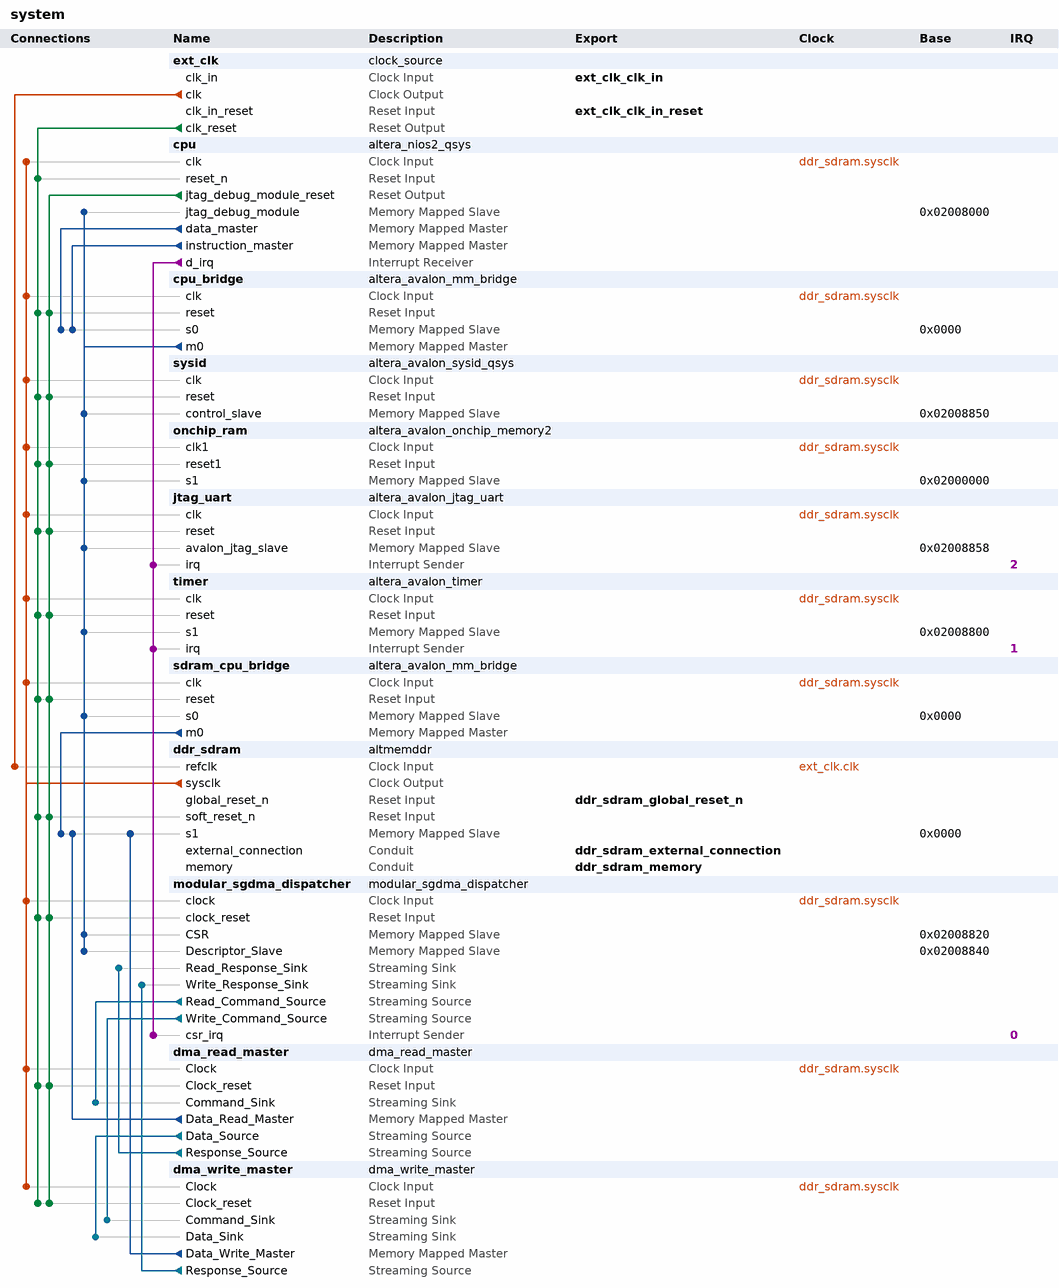
[diagram p0: system contents]
# Platform Designer (Qsys) system system, Cyclone III EP3C25F324C6
# Parameters at their usual value, and those the tool derives, are not listed.
package require -exact qsys 12.1
create_system system
set_project_property DEVICE_FAMILY {Cyclone III}
set_project_property DEVICE EP3C25F324C6

add_instance ext_clk clock_source 12.1
set_instance_parameter_value ext_clk clockFrequency 50000000

add_instance cpu altera_nios2_qsys 12.1
set_instance_parameter_value cpu manuallyAssignCpuID false
set_instance_parameter_value cpu resetSlave onchip_ram.s1
set_instance_parameter_value cpu exceptionSlave onchip_ram.s1
set_instance_parameter_value cpu breakSlave cpu.jtag_debug_module
set_instance_parameter_value cpu impl Fast
set_instance_parameter_value cpu icache_size 4096

add_instance cpu_bridge altera_avalon_mm_bridge 12.1
set_instance_parameter_value cpu_bridge DATA_WIDTH 32
set_instance_parameter_value cpu_bridge ADDRESS_WIDTH 26
set_instance_parameter_value cpu_bridge ADDRESS_UNITS SYMBOLS
set_instance_parameter_value cpu_bridge MAX_PENDING_RESPONSES 38

add_instance sysid altera_avalon_sysid_qsys 12.1
set_instance_parameter_value sysid id 0

add_instance onchip_ram altera_avalon_onchip_memory2 12.1
set_instance_parameter_value onchip_ram dataWidth 32
set_instance_parameter_value onchip_ram dualPort false
set_instance_parameter_value onchip_ram initMemContent false
set_instance_parameter_value onchip_ram initializationFileName onchip_ram
set_instance_parameter_value onchip_ram memorySize 32768

add_instance jtag_uart altera_avalon_jtag_uart 12.1
set_instance_parameter_value jtag_uart simInteractiveOptions INTERACTIVE_ASCII_OUTPUT

add_instance timer altera_avalon_timer 12.1
set_instance_parameter_value timer period 1
set_instance_parameter_value timer periodUnits MSEC
set_instance_parameter_value timer timerPreset CUSTOM

add_instance sdram_cpu_bridge altera_avalon_mm_bridge 12.1
set_instance_parameter_value sdram_cpu_bridge DATA_WIDTH 32
set_instance_parameter_value sdram_cpu_bridge ADDRESS_WIDTH 25
set_instance_parameter_value sdram_cpu_bridge ADDRESS_UNITS SYMBOLS
set_instance_parameter_value sdram_cpu_bridge MAX_PENDING_RESPONSES 35

add_instance ddr_sdram altmemddr 12.1
set_instance_parameter_value ddr_sdram pipeline_commands false
set_instance_parameter_value ddr_sdram debug_en false
set_instance_parameter_value ddr_sdram export_debug_port false
set_instance_parameter_value ddr_sdram use_generated_memory_model true
set_instance_parameter_value ddr_sdram dedicated_memory_clk_phase_label {Dedicated memory clock phase:}
set_instance_parameter_value ddr_sdram mem_if_clk_mhz 133.0
set_instance_parameter_value ddr_sdram quartus_project_exists false
set_instance_parameter_value ddr_sdram local_if_drate Full
set_instance_parameter_value ddr_sdram enable_v72_rsu false
set_instance_parameter_value ddr_sdram local_if_clk_mhz_label 133.0
set_instance_parameter_value ddr_sdram new_variant false
set_instance_parameter_value ddr_sdram mem_if_memtype {DDR SDRAM}
set_instance_parameter_value ddr_sdram pll_ref_clk_mhz 50.0
set_instance_parameter_value ddr_sdram mem_if_clk_ps_label {(7519 ps)}
set_instance_parameter_value ddr_sdram family {Cyclone III}
set_instance_parameter_value ddr_sdram project_family {Cyclone III}
set_instance_parameter_value ddr_sdram speed_grade 6
set_instance_parameter_value ddr_sdram dedicated_memory_clk_phase 0
set_instance_parameter_value ddr_sdram pll_ref_clk_ps_label {(20000 ps)}
set_instance_parameter_value ddr_sdram avalon_burst_length 1
set_instance_parameter_value ddr_sdram mem_if_clk_pair_count 1
set_instance_parameter_value ddr_sdram mem_if_cs_per_dimm 1
set_instance_parameter_value ddr_sdram pre_latency_label {Fix read latency at:}
set_instance_parameter_value ddr_sdram dedicated_memory_clk_en false
set_instance_parameter_value ddr_sdram mirror_addressing 0
set_instance_parameter_value ddr_sdram mem_if_bankaddr_width 2
set_instance_parameter_value ddr_sdram register_control_word_9 0000
set_instance_parameter_value ddr_sdram mem_if_rowaddr_width 13
set_instance_parameter_value ddr_sdram mem_dyn_deskew_en false
set_instance_parameter_value ddr_sdram post_latency_label {cycles (0 cycles=minimum latency, non-deterministic)}
set_instance_parameter_value ddr_sdram mem_if_dm_pins_en Yes
set_instance_parameter_value ddr_sdram local_if_dwidth_label 32
set_instance_parameter_value ddr_sdram register_control_word_7 0000
set_instance_parameter_value ddr_sdram register_control_word_8 0000
set_instance_parameter_value ddr_sdram mem_if_preset {PSC A2S56D40CTP-G5}
set_instance_parameter_value ddr_sdram mem_if_pchaddr_bit 10
set_instance_parameter_value ddr_sdram WIDTH_RATIO 4
set_instance_parameter_value ddr_sdram vendor Other
set_instance_parameter_value ddr_sdram register_control_word_3 0000
set_instance_parameter_value ddr_sdram register_control_word_4 0000
set_instance_parameter_value ddr_sdram chip_or_dimm {Discrete Device}
set_instance_parameter_value ddr_sdram register_control_word_5 0000
set_instance_parameter_value ddr_sdram register_control_word_6 0000
set_instance_parameter_value ddr_sdram mem_fmax 200.0
set_instance_parameter_value ddr_sdram register_control_word_0 0000
set_instance_parameter_value ddr_sdram register_control_word_size 4
set_instance_parameter_value ddr_sdram register_control_word_1 0000
set_instance_parameter_value ddr_sdram register_control_word_2 0000
set_instance_parameter_value ddr_sdram register_control_word_11 0000
set_instance_parameter_value ddr_sdram register_control_word_10 0000
set_instance_parameter_value ddr_sdram mem_if_cs_width 1
set_instance_parameter_value ddr_sdram mem_if_preset_rlat 0
set_instance_parameter_value ddr_sdram mem_if_cs_per_rank 1
set_instance_parameter_value ddr_sdram fast_simulation_en FAST
set_instance_parameter_value ddr_sdram register_control_word_15 0000
set_instance_parameter_value ddr_sdram register_control_word_14 0000
set_instance_parameter_value ddr_sdram mem_if_dwidth 16
set_instance_parameter_value ddr_sdram mem_if_dq_per_dqs 8
set_instance_parameter_value ddr_sdram mem_if_coladdr_width 9
set_instance_parameter_value ddr_sdram register_control_word_13 0000
set_instance_parameter_value ddr_sdram register_control_word_12 0000
set_instance_parameter_value ddr_sdram mem_tiha_ps 600
set_instance_parameter_value ddr_sdram mem_tdsh_ck 0.2
set_instance_parameter_value ddr_sdram mem_if_trfc_ns 70.0
set_instance_parameter_value ddr_sdram mem_tqh_ck 0.36
set_instance_parameter_value ddr_sdram mem_tisa_ps 600
set_instance_parameter_value ddr_sdram mem_tdss_ck 0.2
set_instance_parameter_value ddr_sdram mem_trtp_ns 0.0
set_instance_parameter_value ddr_sdram mem_if_tinit_us 200.0
set_instance_parameter_value ddr_sdram mem_if_trcd_ns 15.0
set_instance_parameter_value ddr_sdram mem_if_twtr_ck 2
set_instance_parameter_value ddr_sdram mem_trrd_ns 10.0
set_instance_parameter_value ddr_sdram mem_tdqss_ck 0.28
set_instance_parameter_value ddr_sdram mem_tqhs_ps 500
set_instance_parameter_value ddr_sdram mem_tdsa_ps 400
set_instance_parameter_value ddr_sdram mem_tac_ps 700
set_instance_parameter_value ddr_sdram mem_tdha_ps 400
set_instance_parameter_value ddr_sdram mem_if_tras_ns 40.0
set_instance_parameter_value ddr_sdram mem_if_twr_ns 15.0
set_instance_parameter_value ddr_sdram mem_tdqsck_ps 550
set_instance_parameter_value ddr_sdram mem_if_trp_ns 15.0
set_instance_parameter_value ddr_sdram mem_tdqsq_ps 400
set_instance_parameter_value ddr_sdram mem_if_tmrd_ns 10.0
set_instance_parameter_value ddr_sdram mem_tfaw_ns 0.0
set_instance_parameter_value ddr_sdram mem_if_trefi_us 7.0
set_instance_parameter_value ddr_sdram mem_tcl_40_fmax 533.0
set_instance_parameter_value ddr_sdram mem_odt Disabled
set_instance_parameter_value ddr_sdram mp_WLH_percent 0.6
set_instance_parameter_value ddr_sdram mem_drv_str Normal
set_instance_parameter_value ddr_sdram mp_DH_percent 0.5
set_instance_parameter_value ddr_sdram input_period 0
set_instance_parameter_value ddr_sdram mp_QH_percent 0.5
set_instance_parameter_value ddr_sdram mp_QHS_percent 0.5
set_instance_parameter_value ddr_sdram mem_tcl_30_fmax 200.0
set_instance_parameter_value ddr_sdram ac_clk_select 90
set_instance_parameter_value ddr_sdram mp_DQSQ_percent 0.65
set_instance_parameter_value ddr_sdram mp_DS_percent 0.6
set_instance_parameter_value ddr_sdram pll_reconfig_ports_en false
set_instance_parameter_value ddr_sdram mem_btype Sequential
set_instance_parameter_value ddr_sdram mp_IS_percent 0.7
set_instance_parameter_value ddr_sdram mem_tcl 3.0
set_instance_parameter_value ddr_sdram mp_DQSS_percent 0.5
set_instance_parameter_value ddr_sdram export_bank_info false
set_instance_parameter_value ddr_sdram mp_DSS_percent 0.6
set_instance_parameter_value ddr_sdram mem_dll_en Yes
set_instance_parameter_value ddr_sdram ac_phase 90
set_instance_parameter_value ddr_sdram mem_if_oct_en false
set_instance_parameter_value ddr_sdram mem_tcl_60_fmax 533.0
set_instance_parameter_value ddr_sdram mp_DSH_percent 0.6
set_instance_parameter_value ddr_sdram mem_if_dqsn_en false
set_instance_parameter_value ddr_sdram enable_mp_calibration true
set_instance_parameter_value ddr_sdram mp_IH_percent 0.6
set_instance_parameter_value ddr_sdram mem_tcl_15_fmax 533.0
set_instance_parameter_value ddr_sdram dll_external false
set_instance_parameter_value ddr_sdram mem_bl 4
set_instance_parameter_value ddr_sdram mp_WLS_percent 0.7
set_instance_parameter_value ddr_sdram mem_tcl_50_fmax 533.0
set_instance_parameter_value ddr_sdram mp_DQSCK_percent 0.5
set_instance_parameter_value ddr_sdram mem_tcl_25_fmax 200.0
set_instance_parameter_value ddr_sdram mem_tcl_20_fmax 133.333
set_instance_parameter_value ddr_sdram cfg_reorder_data true
set_instance_parameter_value ddr_sdram ctl_ecc_en false
set_instance_parameter_value ddr_sdram ctl_hrb_en false
set_instance_parameter_value ddr_sdram ref_clk_source ext_clk
set_instance_parameter_value ddr_sdram cfg_data_reordering_type INTER_BANK
set_instance_parameter_value ddr_sdram ctl_powerdn_en false
set_instance_parameter_value ddr_sdram multicast_wr_en false
set_instance_parameter_value ddr_sdram auto_powerdn_cycles 0
set_instance_parameter_value ddr_sdram ctl_self_refresh_en false
set_instance_parameter_value ddr_sdram cfg_starve_limit 10
set_instance_parameter_value ddr_sdram ctl_latency 0
set_instance_parameter_value ddr_sdram tool_context SOPC_BUILDER
set_instance_parameter_value ddr_sdram mem_addr_mapping CHIP_ROW_BANK_COL
set_instance_parameter_value ddr_sdram burst_merge_en false
set_instance_parameter_value ddr_sdram user_refresh_en false
set_instance_parameter_value ddr_sdram qsys_mode true
set_instance_parameter_value ddr_sdram clk_source_sharing_en false
set_instance_parameter_value ddr_sdram ctl_lookahead_depth 4
set_instance_parameter_value ddr_sdram ctl_autopch_en false
set_instance_parameter_value ddr_sdram ctl_dynamic_bank_allocation false
set_instance_parameter_value ddr_sdram ctl_dynamic_bank_num 4
set_instance_parameter_value ddr_sdram local_if_type_avalon true
set_instance_parameter_value ddr_sdram csr_en false
set_instance_parameter_value ddr_sdram ctl_auto_correct_en false
set_instance_parameter_value ddr_sdram auto_powerdn_en false
set_instance_parameter_value ddr_sdram phy_if_type_afi true
set_instance_parameter_value ddr_sdram controller_type ngv110_ctl
set_instance_parameter_value ddr_sdram max_local_size 2
set_instance_parameter_value ddr_sdram mem_srtr Normal
set_instance_parameter_value ddr_sdram mem_mpr_loc {Predefined Pattern}
set_instance_parameter_value ddr_sdram dss_tinit_rst_us 200.0
set_instance_parameter_value ddr_sdram mem_tcl_90_fmax 400.0
set_instance_parameter_value ddr_sdram mem_rtt_wr {Dynamic ODT off}
set_instance_parameter_value ddr_sdram mem_tcl_100_fmax 400.0
set_instance_parameter_value ddr_sdram mem_pasr {Full Array}
set_instance_parameter_value ddr_sdram mem_asrm {Manual SR Reference (SRT)}
set_instance_parameter_value ddr_sdram mem_mpr_oper {Predefined Pattern}
set_instance_parameter_value ddr_sdram mem_tcl_80_fmax 400.0
set_instance_parameter_value ddr_sdram mem_drv_impedance RZQ/7
set_instance_parameter_value ddr_sdram mem_rtt_nom {ODT Disabled}
set_instance_parameter_value ddr_sdram mem_tcl_70_fmax 400.0
set_instance_parameter_value ddr_sdram mem_wtcl 5.0
set_instance_parameter_value ddr_sdram mem_dll_pch {Fast Exit}
set_instance_parameter_value ddr_sdram mem_atcl Disabled
set_instance_parameter_value ddr_sdram board_settings_valid true
set_instance_parameter_value ddr_sdram t_IH 0.6
set_instance_parameter_value ddr_sdram board_intra_DQS_group_skew 0.02
set_instance_parameter_value ddr_sdram isi_DQS 0.0
set_instance_parameter_value ddr_sdram addr_cmd_slew_rate 1.0
set_instance_parameter_value ddr_sdram board_tpd_inter_DIMM 0.05
set_instance_parameter_value ddr_sdram board_addresscmd_CK_skew 0.0
set_instance_parameter_value ddr_sdram t_DS_calculated 0.400
set_instance_parameter_value ddr_sdram isi_addresscmd_hold 0.0
set_instance_parameter_value ddr_sdram t_IS 0.6
set_instance_parameter_value ddr_sdram restore_default_toggle false
set_instance_parameter_value ddr_sdram dqs_dqsn_slew_rate 2.0
set_instance_parameter_value ddr_sdram dq_slew_rate 1.0
set_instance_parameter_value ddr_sdram board_inter_DQS_group_skew 0.02
set_instance_parameter_value ddr_sdram isi_addresscmd_setup 0.0
set_instance_parameter_value ddr_sdram board_minCK_DQS_skew -0.01
set_instance_parameter_value ddr_sdram t_IS_calculated 0.600
set_instance_parameter_value ddr_sdram num_slots_or_devices 1
set_instance_parameter_value ddr_sdram board_maxCK_DQS_skew 0.01
set_instance_parameter_value ddr_sdram board_skew_ps 20
set_instance_parameter_value ddr_sdram t_DH 0.4
set_instance_parameter_value ddr_sdram ck_ckn_slew_rate 2.0
set_instance_parameter_value ddr_sdram isi_DQ 0.0
set_instance_parameter_value ddr_sdram t_IH_calculated 0.600
set_instance_parameter_value ddr_sdram t_DH_calculated 0.400
set_instance_parameter_value ddr_sdram t_DS 0.4

add_instance modular_sgdma_dispatcher modular_sgdma_dispatcher 1.0
set_instance_parameter_value modular_sgdma_dispatcher MODE 0
set_instance_parameter_value modular_sgdma_dispatcher GUI_RESPONSE_PORT 2
set_instance_parameter_value modular_sgdma_dispatcher DESCRIPTOR_FIFO_DEPTH 128
set_instance_parameter_value modular_sgdma_dispatcher ENHANCED_FEATURES 0
set_instance_parameter_value modular_sgdma_dispatcher CSR_ADDRESS_WIDTH 3

add_instance dma_read_master dma_read_master 1.0
set_instance_parameter_value dma_read_master DATA_WIDTH 32
set_instance_parameter_value dma_read_master LENGTH_WIDTH 20
set_instance_parameter_value dma_read_master FIFO_DEPTH 64
set_instance_parameter_value dma_read_master STRIDE_ENABLE 0
set_instance_parameter_value dma_read_master GUI_STRIDE_WIDTH 1
set_instance_parameter_value dma_read_master BURST_ENABLE 1
set_instance_parameter_value dma_read_master GUI_MAX_BURST_COUNT 2
set_instance_parameter_value dma_read_master GUI_PROGRAMMABLE_BURST_ENABLE 0
set_instance_parameter_value dma_read_master GUI_BURST_WRAPPING_SUPPORT 1
set_instance_parameter_value dma_read_master TRANSFER_TYPE {Aligned Accesses}
set_instance_parameter_value dma_read_master PACKET_ENABLE 0
set_instance_parameter_value dma_read_master ERROR_ENABLE 0
set_instance_parameter_value dma_read_master ERROR_WIDTH 8
set_instance_parameter_value dma_read_master CHANNEL_ENABLE 0
set_instance_parameter_value dma_read_master CHANNEL_WIDTH 8
set_instance_parameter_value dma_read_master ADDRESS_WIDTH 25
set_instance_parameter_value dma_read_master FIFO_SPEED_OPTIMIZATION 1

add_instance dma_write_master dma_write_master 1.0
set_instance_parameter_value dma_write_master DATA_WIDTH 32
set_instance_parameter_value dma_write_master LENGTH_WIDTH 20
set_instance_parameter_value dma_write_master FIFO_DEPTH 64
set_instance_parameter_value dma_write_master STRIDE_ENABLE 0
set_instance_parameter_value dma_write_master GUI_STRIDE_WIDTH 1
set_instance_parameter_value dma_write_master BURST_ENABLE 1
set_instance_parameter_value dma_write_master GUI_MAX_BURST_COUNT 2
set_instance_parameter_value dma_write_master GUI_PROGRAMMABLE_BURST_ENABLE 0
set_instance_parameter_value dma_write_master GUI_BURST_WRAPPING_SUPPORT 1
set_instance_parameter_value dma_write_master TRANSFER_TYPE {Aligned Accesses}
set_instance_parameter_value dma_write_master PACKET_ENABLE 0
set_instance_parameter_value dma_write_master ERROR_ENABLE 0
set_instance_parameter_value dma_write_master ERROR_WIDTH 8
set_instance_parameter_value dma_write_master ADDRESS_WIDTH 25
set_instance_parameter_value dma_write_master FIFO_SPEED_OPTIMIZATION 1

# connections
add_connection ddr_sdram.sysclk cpu.clk clock
add_connection ddr_sdram.sysclk cpu_bridge.clk clock
add_connection ddr_sdram.sysclk dma_read_master.Clock clock
add_connection ddr_sdram.sysclk dma_write_master.Clock clock
add_connection ddr_sdram.sysclk jtag_uart.clk clock
add_connection ddr_sdram.sysclk modular_sgdma_dispatcher.clock clock
add_connection ddr_sdram.sysclk onchip_ram.clk1 clock
add_connection ddr_sdram.sysclk sdram_cpu_bridge.clk clock
add_connection ddr_sdram.sysclk sysid.clk clock
add_connection ddr_sdram.sysclk timer.clk clock
add_connection ext_clk.clk ddr_sdram.refclk clock
add_connection cpu.jtag_debug_module_reset cpu_bridge.reset reset
add_connection cpu.jtag_debug_module_reset ddr_sdram.soft_reset_n reset
add_connection cpu.jtag_debug_module_reset dma_read_master.Clock_reset reset
add_connection cpu.jtag_debug_module_reset dma_write_master.Clock_reset reset
add_connection cpu.jtag_debug_module_reset jtag_uart.reset reset
add_connection cpu.jtag_debug_module_reset modular_sgdma_dispatcher.clock_reset reset
add_connection cpu.jtag_debug_module_reset onchip_ram.reset1 reset
add_connection cpu.jtag_debug_module_reset sdram_cpu_bridge.reset reset
add_connection cpu.jtag_debug_module_reset sysid.reset reset
add_connection cpu.jtag_debug_module_reset timer.reset reset
add_connection ext_clk.clk_reset cpu.reset_n reset
add_connection ext_clk.clk_reset cpu_bridge.reset reset
add_connection ext_clk.clk_reset ddr_sdram.soft_reset_n reset
add_connection ext_clk.clk_reset dma_read_master.Clock_reset reset
add_connection ext_clk.clk_reset dma_write_master.Clock_reset reset
add_connection ext_clk.clk_reset jtag_uart.reset reset
add_connection ext_clk.clk_reset modular_sgdma_dispatcher.clock_reset reset
add_connection ext_clk.clk_reset onchip_ram.reset1 reset
add_connection ext_clk.clk_reset sdram_cpu_bridge.reset reset
add_connection ext_clk.clk_reset sysid.reset reset
add_connection ext_clk.clk_reset timer.reset reset
add_connection cpu.data_master cpu_bridge.s0 avalon
set_connection_parameter_value cpu.data_master/cpu_bridge.s0 baseAddress 0x0000
add_connection cpu.instruction_master cpu_bridge.s0 avalon
set_connection_parameter_value cpu.instruction_master/cpu_bridge.s0 baseAddress 0x0000
add_connection cpu_bridge.m0 cpu.jtag_debug_module avalon
set_connection_parameter_value cpu_bridge.m0/cpu.jtag_debug_module baseAddress 0x02008000
add_connection cpu_bridge.m0 jtag_uart.avalon_jtag_slave avalon
set_connection_parameter_value cpu_bridge.m0/jtag_uart.avalon_jtag_slave baseAddress 0x02008858
add_connection cpu_bridge.m0 modular_sgdma_dispatcher.CSR avalon
set_connection_parameter_value cpu_bridge.m0/modular_sgdma_dispatcher.CSR baseAddress 0x02008820
add_connection cpu_bridge.m0 modular_sgdma_dispatcher.Descriptor_Slave avalon
set_connection_parameter_value cpu_bridge.m0/modular_sgdma_dispatcher.Descriptor_Slave baseAddress 0x02008840
add_connection cpu_bridge.m0 onchip_ram.s1 avalon
set_connection_parameter_value cpu_bridge.m0/onchip_ram.s1 baseAddress 0x02000000
add_connection cpu_bridge.m0 sdram_cpu_bridge.s0 avalon
set_connection_parameter_value cpu_bridge.m0/sdram_cpu_bridge.s0 baseAddress 0x0000
add_connection cpu_bridge.m0 sysid.control_slave avalon
set_connection_parameter_value cpu_bridge.m0/sysid.control_slave baseAddress 0x02008850
add_connection cpu_bridge.m0 timer.s1 avalon
set_connection_parameter_value cpu_bridge.m0/timer.s1 baseAddress 0x02008800
add_connection dma_read_master.Data_Read_Master ddr_sdram.s1 avalon
set_connection_parameter_value dma_read_master.Data_Read_Master/ddr_sdram.s1 baseAddress 0x0000
add_connection dma_write_master.Data_Write_Master ddr_sdram.s1 avalon
set_connection_parameter_value dma_write_master.Data_Write_Master/ddr_sdram.s1 baseAddress 0x0000
add_connection sdram_cpu_bridge.m0 ddr_sdram.s1 avalon
set_connection_parameter_value sdram_cpu_bridge.m0/ddr_sdram.s1 baseAddress 0x0000
add_connection dma_read_master.Data_Source dma_write_master.Data_Sink avalon_streaming
add_connection dma_read_master.Response_Source modular_sgdma_dispatcher.Read_Response_Sink avalon_streaming
add_connection dma_write_master.Response_Source modular_sgdma_dispatcher.Write_Response_Sink avalon_streaming
add_connection modular_sgdma_dispatcher.Read_Command_Source dma_read_master.Command_Sink avalon_streaming
add_connection modular_sgdma_dispatcher.Write_Command_Source dma_write_master.Command_Sink avalon_streaming
add_connection cpu.d_irq jtag_uart.irq interrupt
set_connection_parameter_value cpu.d_irq/jtag_uart.irq irqNumber 2
add_connection cpu.d_irq modular_sgdma_dispatcher.csr_irq interrupt
set_connection_parameter_value cpu.d_irq/modular_sgdma_dispatcher.csr_irq irqNumber 0
add_connection cpu.d_irq timer.irq interrupt
set_connection_parameter_value cpu.d_irq/timer.irq irqNumber 1

# exported interfaces
add_interface ext_clk_clk_in_reset reset sink
set_interface_property ext_clk_clk_in_reset EXPORT_OF ext_clk.clk_in_reset
add_interface ddr_sdram_external_connection conduit end
set_interface_property ddr_sdram_external_connection EXPORT_OF ddr_sdram.external_connection
add_interface ext_clk_clk_in clock sink
set_interface_property ext_clk_clk_in EXPORT_OF ext_clk.clk_in
add_interface ddr_sdram_memory conduit end
set_interface_property ddr_sdram_memory EXPORT_OF ddr_sdram.memory
add_interface ddr_sdram_global_reset_n reset sink
set_interface_property ddr_sdram_global_reset_n EXPORT_OF ddr_sdram.global_reset_n

save_system system.qsys
